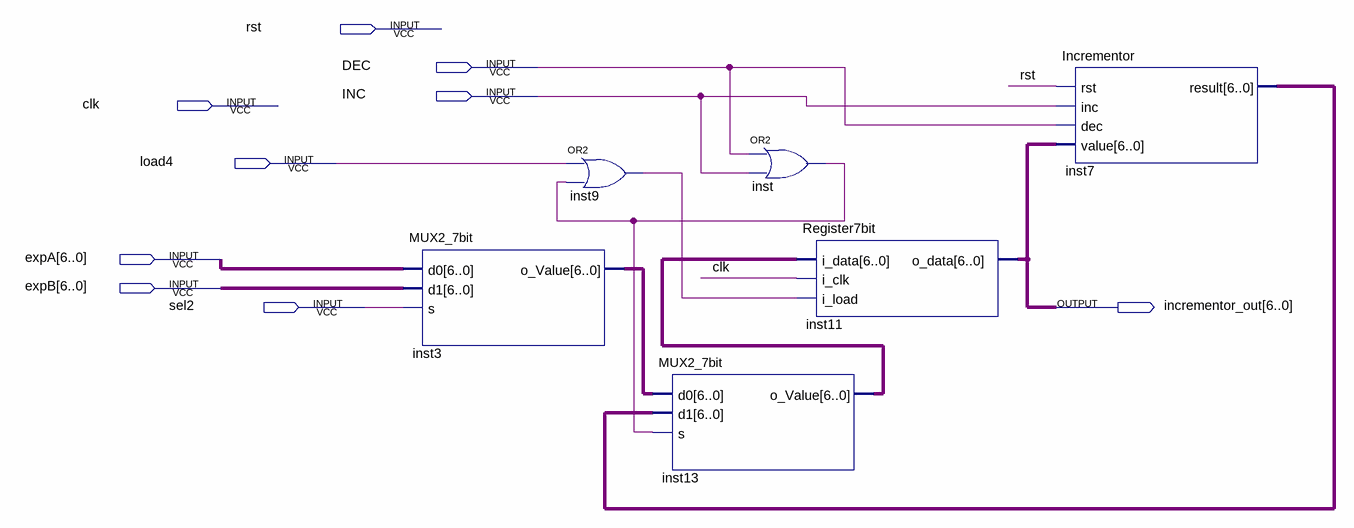
[diagram p0: schematic sheet]
// Quartus schematic incrementor_reg.bdf as structural Verilog: 6 symbols, 9 pins
module incrementor_reg (
  input  rst,
  input  DEC,
  input  INC,
  input  clk,
  input  load4,
  input  [6:0] expA,
  input  [6:0] expB,
  input  sel2,
  output [6:0] incrementor_out
);

  wire inst9_out, inst_out;
  wire [6:0] inst3_o_value, inst7_result, inst13_o_value;

  MUX2_7bit inst3 (.d0(expA), .d1(expB), .s(sel2), .o_Value(inst3_o_value));
  or inst9 (inst9_out, load4, inst_out);
  MUX2_7bit inst13 (.d0(inst3_o_value), .d1(inst7_result), .s(inst_out), .o_Value(inst13_o_value));
  or inst (inst_out, DEC, INC);
  Register7bit inst11 (.i_data(inst13_o_value), .i_clk(clk), .i_load(inst9_out), .o_data(incrementor_out));
  Incrementor inst7 (.rst(rst), .inc(INC), .dec(DEC), .value(incrementor_out), .result(inst7_result));
endmodule
